# EAGLE design bootloader_burner (EAGLE 9.6.2)
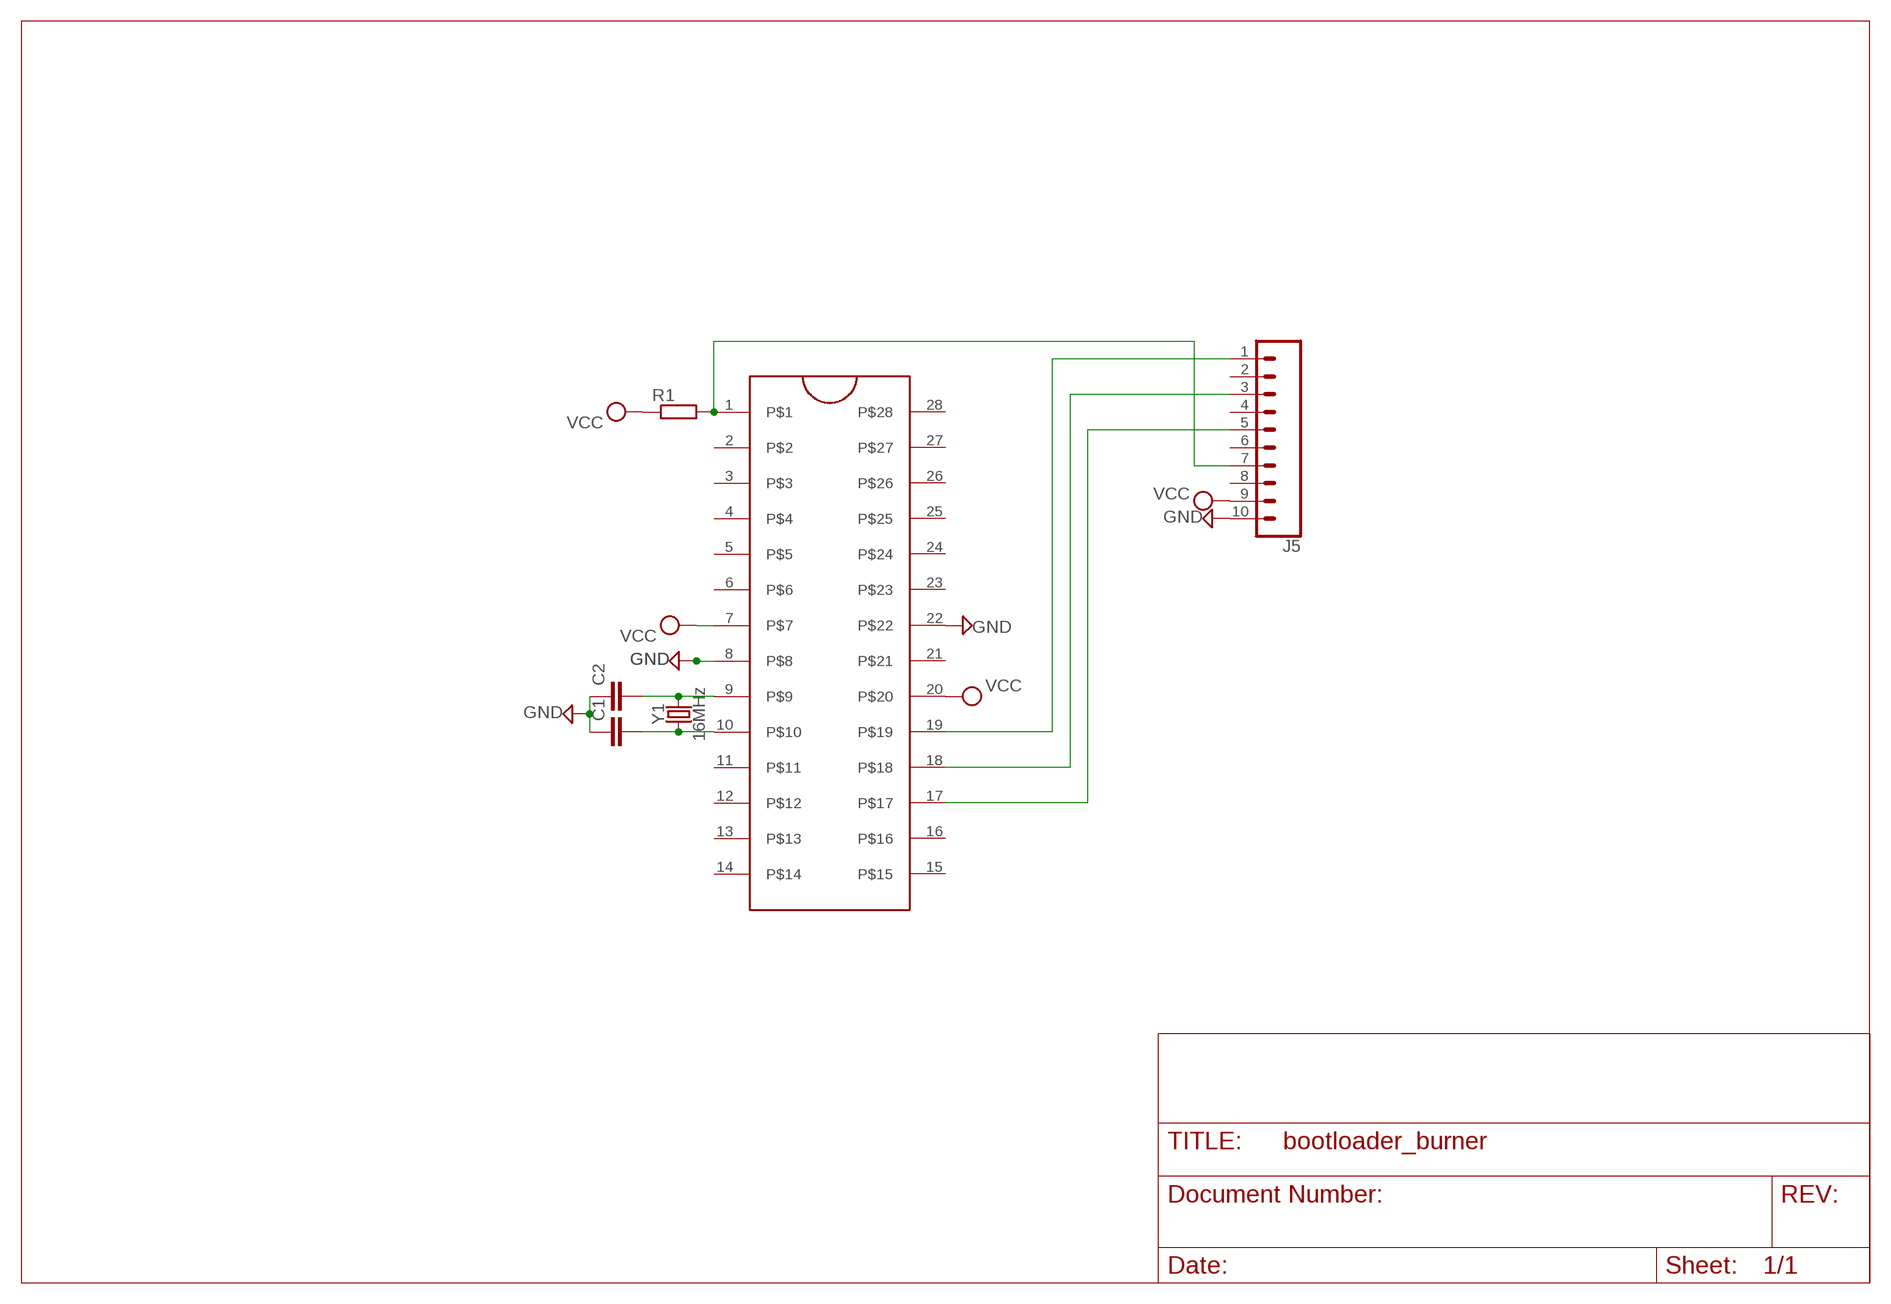
[diagram p0: schematic, sheet 1]

## Parts
C1  C-EU025-025X050  [C025-025X050]
C2  C-EU025-025X050  [C025-025X050]
J1  ZIFSOCKET-28-3"  [DIL28-3-ZIF_SOCKET]
J5  CONN_10"  [1X10]
R1  R-EU_0207/10  [0207/10]
Y1  16MHz  CRYSTAL-16MHZPTH-HC49US  [HC49US]

## Nets
GND: C1.1 C2.1 J1.8 J1.22 J5.10
N$4: C2.2 J1.9 Y1.2
N$5: C1.2 J1.10 Y1.1
PIN_10: J1.1 J5.7 R1.2
PIN_11: J1.17 J5.5
PIN_12: J1.18 J5.3
PIN_13: J1.19 J5.1
VCC: J1.7 J1.20 J5.9 R1.1
Unconnected: J1.2 J1.3 J1.4 J1.5 J1.6 J1.11 J1.12 J1.13 J1.14 J1.15 J1.16 J1.21 J1.23 J1.24 J1.25 J1.26 J1.27 J1.28 J5.2 J5.4 J5.6 J5.8

## Library data of the parts
C1 C2 = rcl_capacitor:C-EU: CAPACITOR, European symbol; SPICEPREFIX: C
J1 = SparkFun-Connectors:ZIFSOCKET-28-3: ZIF Socket 28-Pin 0.3" Lever-action ZIF socket for 28-pin ICs SparkFun Products: ZIF Socket 28-Pin <https://www.sparkfun.com/products/9175>; PROD_ID: CONN-10960; SF_ID: PRT-09175
J5 = SparkFun-Connectors:CONN_10: Multi connection point. Often used as Generic Header-pin footprint for 0.1 inch spaced/style header connections On any of the 0.1 inch spaced packages, you can populate with these: Break Away Headers - Straight <https://www.sparkfun.com/products/116> (PRT-00116) Break Away Male Headers - Right Angle <https://www.sparkfun.com/products/553> (PRT-00553) Female Headers <https://www.sparkfun.com/products/115> (PRT-00115) Break Away Headers - Machine Pin <https://www.sparkfun.com/products/117> (PRT-00117) Break Away Female Headers - Swiss Machine Pin <https://www.sparkfun.com/products/743> (PRT-00743) Arduino Stackable Header - 10 Pin <https://www.sparkfun.com/products/11376> (PRT-11376) For SCREWTERMINALS and SPRING TERMINALS visit here: Screw Terimnals on SparkFun.com <https://www.sparkfun.com/search/results?term=Screw+Terminals> (5mm/3.5mm/2.54mm spacing) This device is also useful as a general connection point to wire up your design to another part of your project. Our various solder wires solder well into these plated through hole pads. Hook-Up Wire - Assortment (Stranded, 22 AWG) <https://www.sparkfun.com/products/11375> (PRT-11375) Hook-Up Wire - Assortment (Solid Core, 22 AWG) <https://www.sparkfun.com/products/11367> (PRT-11367) View the entire wire category on our website here <https://www.sparkfun.com/categories/141> Special notes: Molex polarized connector foot print use with SKU : PRT-08231 with associated crimp pins and housings. 1MM SMD Version SKU: PRT-10208 NOTES ON THE VARIANTS LOCK and LOCK_LONGPADS... This footprint was designed to help hold the alignment of a through-hole component (i.e. 6-pin header) while soldering it into place. You may notice that each hole has been shifted either up or down by 0.005 of an inch from it's more standard position (which is a perfectly straight line). This slight alteration caused the pins (the squares in the middle) to touch the edges of the holes. Because they are alternating, it causes a "brace" to hold the component in place. 0.005 has proven to be the perfect amount of "off-center" position when using our standard breakaway headers. Although looks a little odd when you look at the bare footprint, once you have a header in there, the alteration is very hard to notice. Also,if you push a header all the way into place, it is covered up entirely on the bottom side.; PROD_ID: CONN-11563
R1 = rcl:R-EU_: RESISTOR, European symbol; SPICEPREFIX: R
Y1 = SparkFun-Clocks:CRYSTAL-16MHZ: 16MHz Crystal Digikey Example <http://www.digikey.com/product-search/en?keywords=535-9122-1-ND> Frequency: 16MHz Frequency Stability: ±50ppm Frequency Tolerance: ±20ppm Load Capacitance: 18pF SparkFun Products: Pro Micro -5V/16MHz <https://www.sparkfun.com/products/12640> SparkFun Serial Enabled LCD Kit <https://www.sparkfun.com/products/10097>; PROD_ID: XTAL-08181; SF_ID: COM-00536

## Net classes
0 default: clearance 0.205 mm

## Board
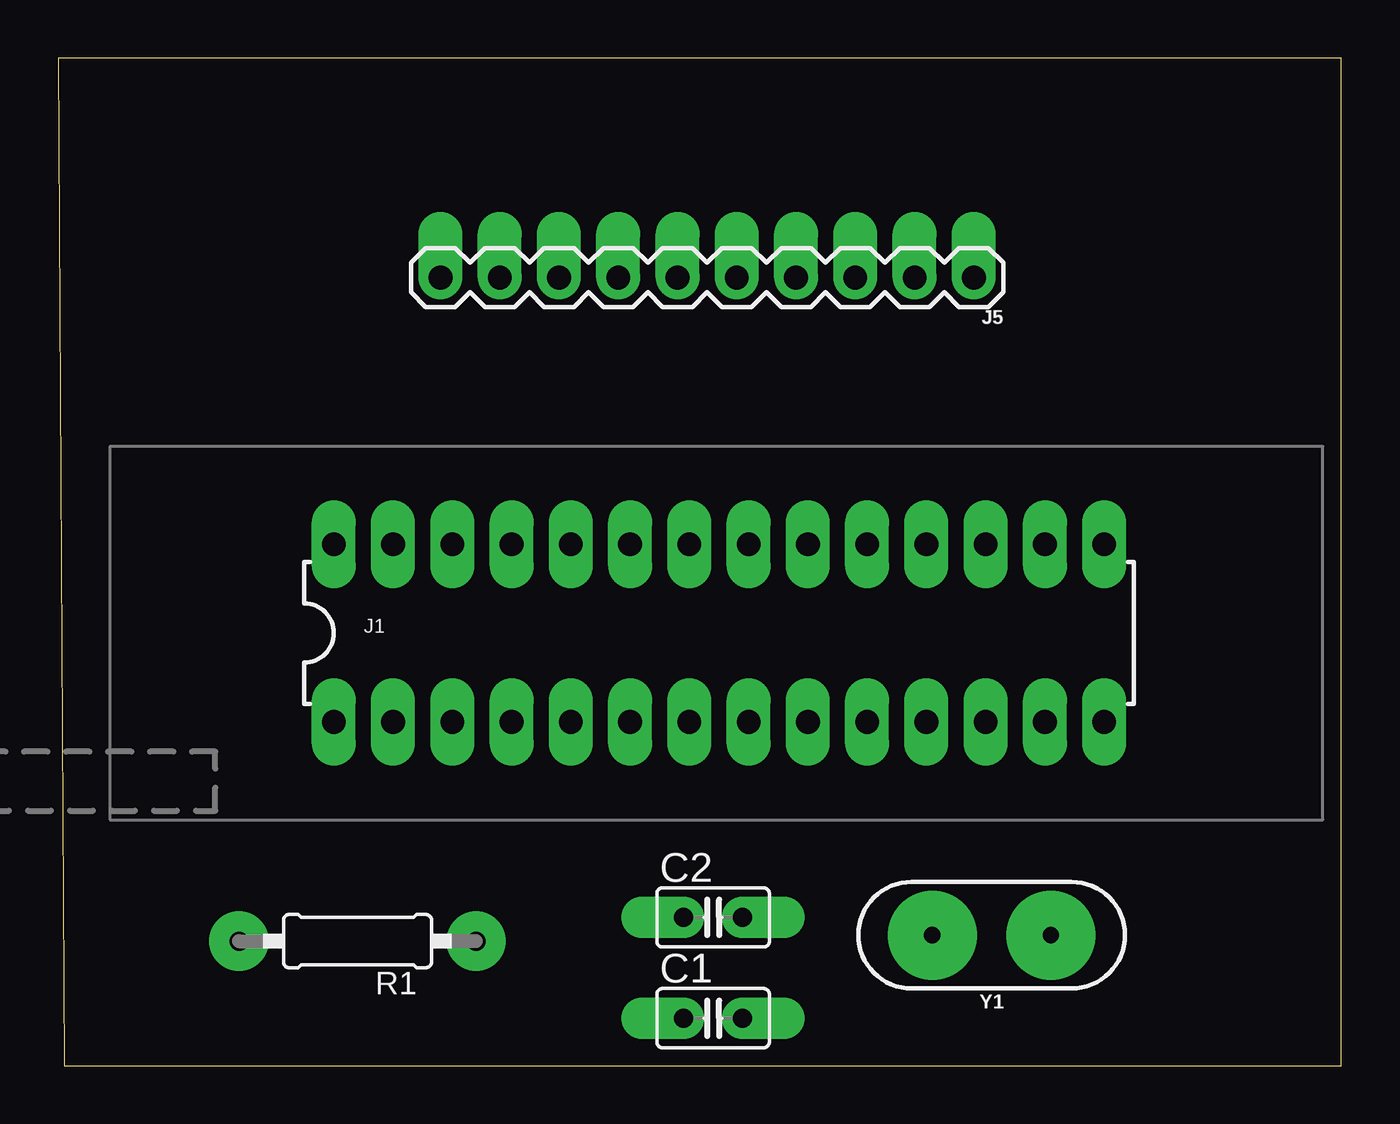
[diagram p1: board, top side]
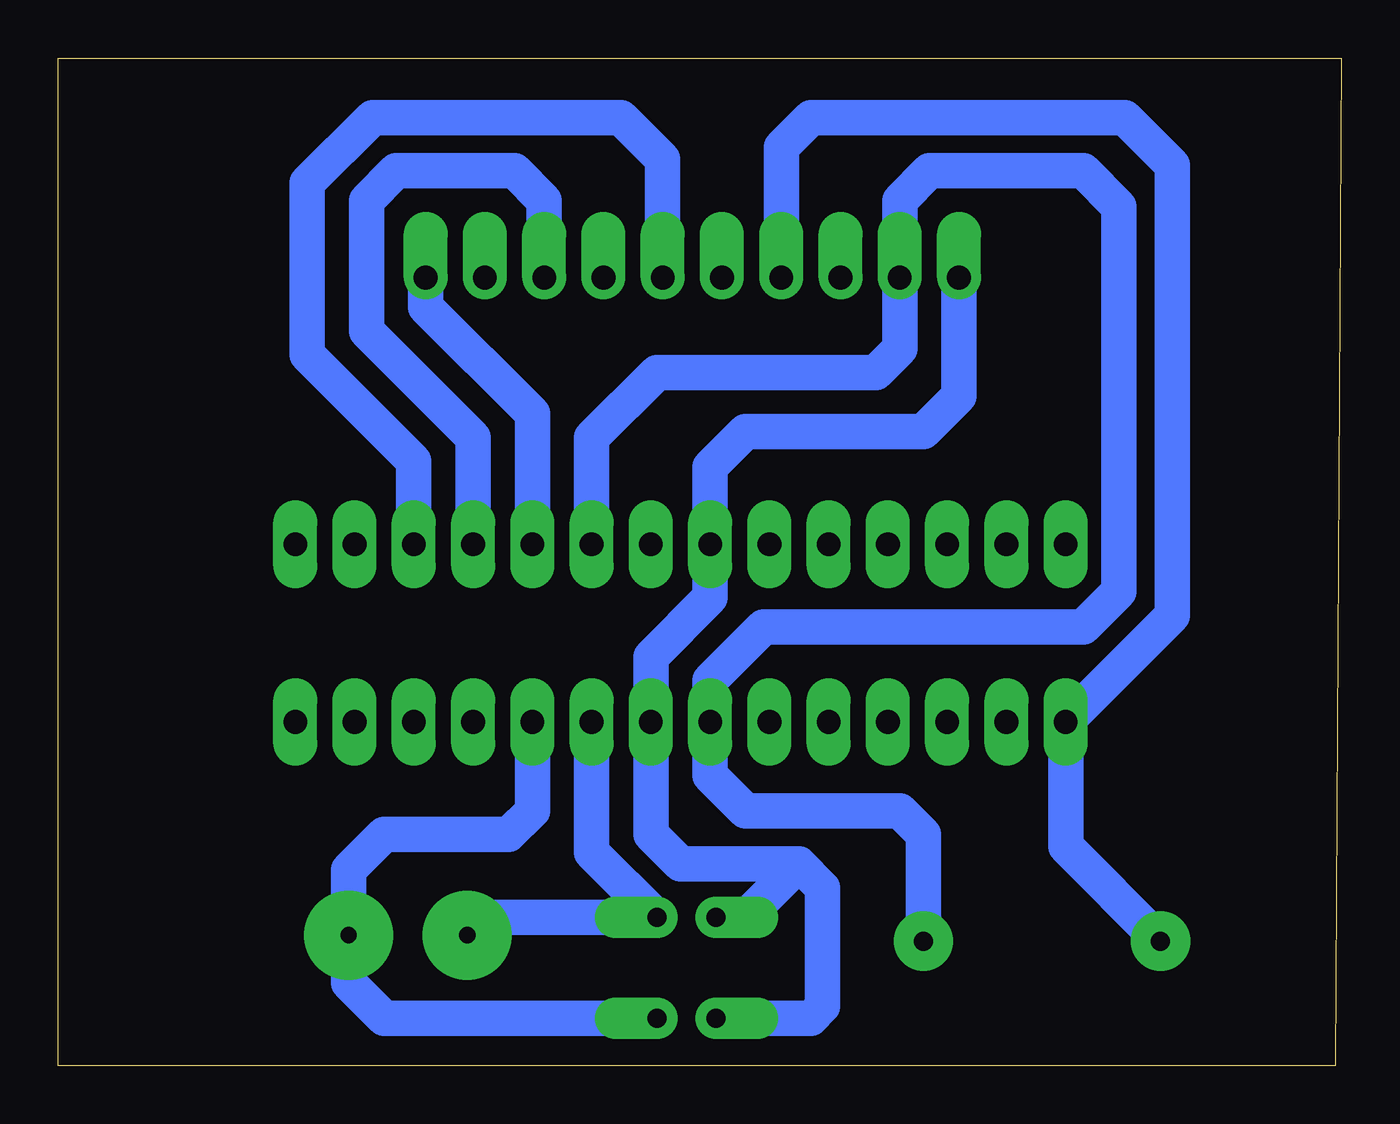
[diagram p2: board, bottom side, seen from below]

Size 54.99 x 43.18 mm. Coordinates in mm from the lower left corner, seen from the top.
Outline: 0,43.18 0.25,0 54.99,0 54.99,43.18 0,43.18
Copper layers (1*16): Top 0.035mm / dielectric 1.5mm / Bottom 0.035mm
Design rules "default *": minimum track width 6mil, minimum drill 0.35mm, track to track 6mil, track to pad 6mil, pad to pad 6mil, via to via 6mil, smd to smd 6mil, copper to edge 40mil, drill to drill 6mil, minimum pad ring 15mil, minimum via ring 8mil, stop-mask expansion 4mil, vias tented up to drill 0mil, thermal gap 10mil

### Footprints (pad centres in the part's own frame; a part is rotated, then mirrored left to right if it is on the bottom)
C025-025X050 = drill 0.813 pad 1.778 offset: 1 -1.27,0; 2 1.27,0
DIL28-3-ZIF_SOCKET = drill 1.016 pad 1.88 long: 1 -16.51,-3.81; 2 -13.97,-3.81; 3 -11.43,-3.81; 4 -8.89,-3.81; 5 -6.35,-3.81; 6 -3.81,-3.81; 7 -1.27,-3.81; 8 1.27,-3.81; 9 3.81,-3.81; 10 6.35,-3.81; 11 8.89,-3.81; 12 11.43,-3.81; 13 13.97,-3.81; 14 16.51,-3.81; 15 16.51,3.81; 16 13.97,3.81; 17 11.43,3.81; 18 8.89,3.81; 19 6.35,3.81; 20 3.81,3.81; 21 1.27,3.81; 22 -1.27,3.81; 23 -3.81,3.81; 24 -6.35,3.81; 25 -8.89,3.81; 26 -11.43,3.81; 27 -13.97,3.81; 28 -16.51,3.81
1X10 = drill 1.016 pad 1.88 offset: 1 0,0; 2 2.54,0; 3 5.08,0; 4 7.62,0; 5 10.16,0; 6 12.7,0; 7 15.24,0; 8 17.78,0; 9 20.32,0; 10 22.86,0
0207/10 = drill 0.813 pad 2.54: 1 -5.08,0; 2 5.08,0
HC49US = drill 0.7 pad 3.81: 1 -2.54,0; 2 2.54,0

### Placement (x,y rotation side)
C1  28.07,2.03 0 top
C2  28.07,6.35 0 top
J1  28.32,18.54 0 top
J5  39.24,33.78 180 top
R1  12.83,5.33 180 top
Y1  40,5.59 180 top

### Tracks (layer width: path | path; a pad name or v marks a point on that pad's centre or on a via)
GND
  Bottom 1.524: C1.1 22.73,2.03 22.22,2.54 22.22,7.62 23.24,8.64 | 23.24,8.64 28.32,8.64 29.59,9.91 J1.8 29.59,17.53 27.05,20.07 J1.22 27.05,25.65 25.53,27.18 17.91,27.18 16.38,28.7 J5.10 | C2.1 25.53,6.35 23.24,8.64
N$4
  Bottom 1.524: J1.9 32.13,9.14 C2.2 36.7,6.35 Y1.2
N$5
  Bottom 1.524: C1.2 41.02,2.03 42.54,3.56 Y1.1 42.54,8.38 41.02,9.91 35.69,9.91 34.67,10.92 J1.10
PIN_10
  Bottom 1.524: R1.2 11.81,9.4 J1.1 7.24,19.3 7.24,38.61 9.27,40.64 22.73,40.64 24,39.37 J5.7
PIN_11
  Bottom 1.524: J1.17 39.75,25.91 44.32,30.48 44.32,37.85 41.53,40.64 30.86,40.64 29.08,38.86 J5.5
PIN_12
  Bottom 1.524: J1.18 37.21,26.92 41.78,31.5 41.78,37.08 40.51,38.35 35.43,38.35 34.16,37.08 J5.3
PIN_13
  Bottom 1.524: J1.19 34.67,27.94 39.24,32.51 J5.1
VCC
  Bottom 1.524: R1.1 17.91,9.91 18.92,10.92 25.53,10.92 27.05,12.45 J1.7 27.05,16.51 24.77,18.8 11.05,18.8 9.53,20.32 9.53,36.83 11.05,38.35 17.65,38.35 18.92,37.08 J5.9 18.92,30.73 19.94,29.72 29.34,29.72 32.13,26.92 J1.20